# Altium schematic sheet Sheet1.SchDoc
size A4; SheetNumber: 1; SheetTotal: 1
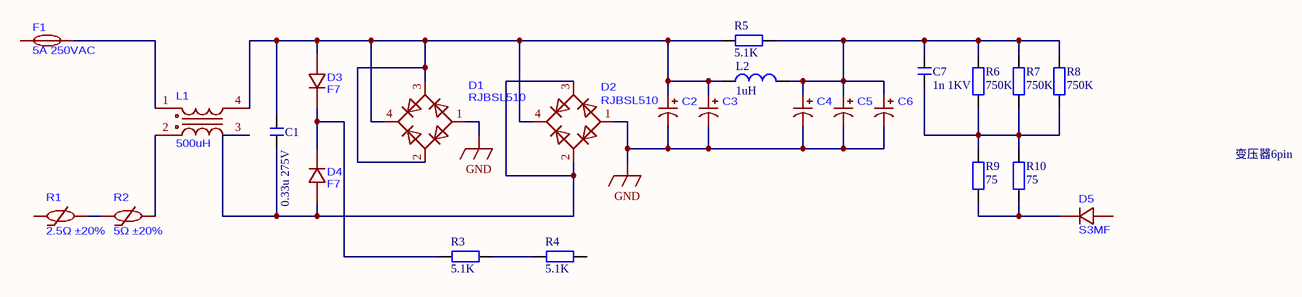
[diagram p0: Sheet1.SchDoc]

## Parts
C1  0.33u 275V  [CAP-TH_L18.0-W8.5-P15.00-D0.8]
C2  33uF 400V  [CAP-TH_BD10.0-P5.00-D0.6-FD]  (value not drawn)
C3  33uF 400V  [CAP-TH_BD10.0-P5.00-D0.6-FD]  (value not drawn)
C4  33uF 400V  [CAP-TH_BD10.0-P5.00-D0.6-FD]  (value not drawn)
C5  33uF 400V  [CAP-TH_BD10.0-P5.00-D0.6-FD]  (value not drawn)
C6  33uF 400V  [CAP-TH_BD10.0-P5.00-D0.6-FD]  (value not drawn)
C7  1n 1KV  [C1206]
D1  RJBSL510  [DIO-BG-SMD_4P-L4.9-W4.0-P2.54-LS7.0-BR]
D2  RJBSL510  [DIO-BG-SMD_4P-L4.9-W4.0-P2.54-LS7.0-BR]
D3  F7  [SOD-123_L2.7-W1.6-LS3.7-RD-1]
D4  F7  [SOD-123_L2.7-W1.6-LS3.7-RD-1]
D5  S3MF  [DO-214AC_L4.3-W2.7-LS5.2-RD]
F1  5A 250VAC  [FUSE-TH_L8.5-W4.0-P5.08-D0.6]
L1  500uH  [FILTER-TH_4P-L17.0-W12.0-P7.00-D0.6-S8.00-1]
L2  1uH  [IND-TH_BD10.5-P5.00-D0.6]
R1  2.5Ω ±20%  [RES-TH_L12.5-W5.1-P7.50-D1.2-S2.20]
R2  5Ω ±20%  [RES-TH_L12.5-W5.1-P7.50-D1.2-S2.20]
R3  5.1K  [R1206]
R4  5.1K  [R1206]
R5  5.1K  [R1206]
R6  750K  [R1206]
R7  750K  [R1206]
R8  750K  [R1206]
R9  75  [R1206]
R10  75  [R1206]

## Nets
GND: C2.2 C3.2 C4.2 C5.2 C6.2 D1.1(-) D2.1(-)
NetC1_1: C1.1 D2.2(C1) D2.3(C2) D4.2(+) L1.3
NetC1_2: C1.2 C2.1 C3.1 D1.2(C1) D1.3(C2) D1.4(+) D2.4(+) D3.2(+) L1.4 L2.1 R5.1
NetC4_1: C4.1 C5.1 C6.1 C7.1 L2.2 R5.2 R6.2 R7.2 R8.2
NetC7_2: C7.2 R6.1 R7.1 R8.1 R9.2 R10.2
NetD3_1: D3.1(-) D4.1(-) R3.1
NetD5_1: D5.1(-) R9.1 R10.1
NetF1_2: F1.2 L1.1
NetL1_2: L1.2 R2.2
NetR1_2: R1.2 R2.1
NetR3_2: R3.2 R4.1

Not connected (* = marked no-connect by the designer): D5 2(+); F1 1; R1 1; R4 2

## Notes on the sheet
- 变压器6pin

## Library data of the parts
C1 = CAP: 安规电容 X2 330nF ±10% 275V; Part_number: MPX334K31D3KN15800; Brand: KNSCHA(科尼盛)
C2-C6 = CAP_1: 电解电容,33uF 400V / C2914377 / C5183780/C781263; Part_number: EKM2GM330G18OTBVZC; Brand: Yunxing(云星)
C7 = CAP: 贴片电容,; Part_number: CC1206KKX7RCBB102; Brand: YAGEO(国巨)
D1 D2 = RJBSL510: 整流桥，1KV，5A; Brand: CJ(江苏长电/长晶); Part_number: RJBSL510
D3 D4 = Diode: Diode,F7; Brand: GOODWORK(固得沃克); Part_number: F7
D5 = Diode: Diode,S3MF; Brand: CJ(江苏长电/长晶); Part_number: S3MF
F1 = Fuse: 一次性保险丝，5A，250VAC / C312477/C354906/C2839767; Part_number: SET T5A 250V; Brand: CHEVRON(诚润电子）
L1 = Common mode Choke: 共模滤波器，500uH / C2923570; Part_number: PDUUAT98-501MLN; Brand: PROD(谱罗德)
L2 = INDUCTOR: 工字电感，22uH; Part_number: XR9*12-220K-L; Brand: XR(祥如)
R1 = NTC: NTC热敏电阻,2.5Ω,±20%,4A; Part_number: R09D2R5MUB4CGWB; Brand: XC(新成）
R2 = NTC: NTC热敏电阻,5Ω,±20%,4A; Part_number: R11D050MUB4CGWB; Brand: XC(新成）
R3-R5 = RES: 贴片电阻; Part_number: RC1206JR-075K1L; Brand: YAGEO(国巨)
R6-R8 = RES: 贴片电阻; Part_number: RC1206JR-07750KL; Brand: YAGEO(国巨)
R9 R10 = RES: 贴片电阻; Part_number: RC1206JR-0775RL; Brand: YAGEO(国巨)